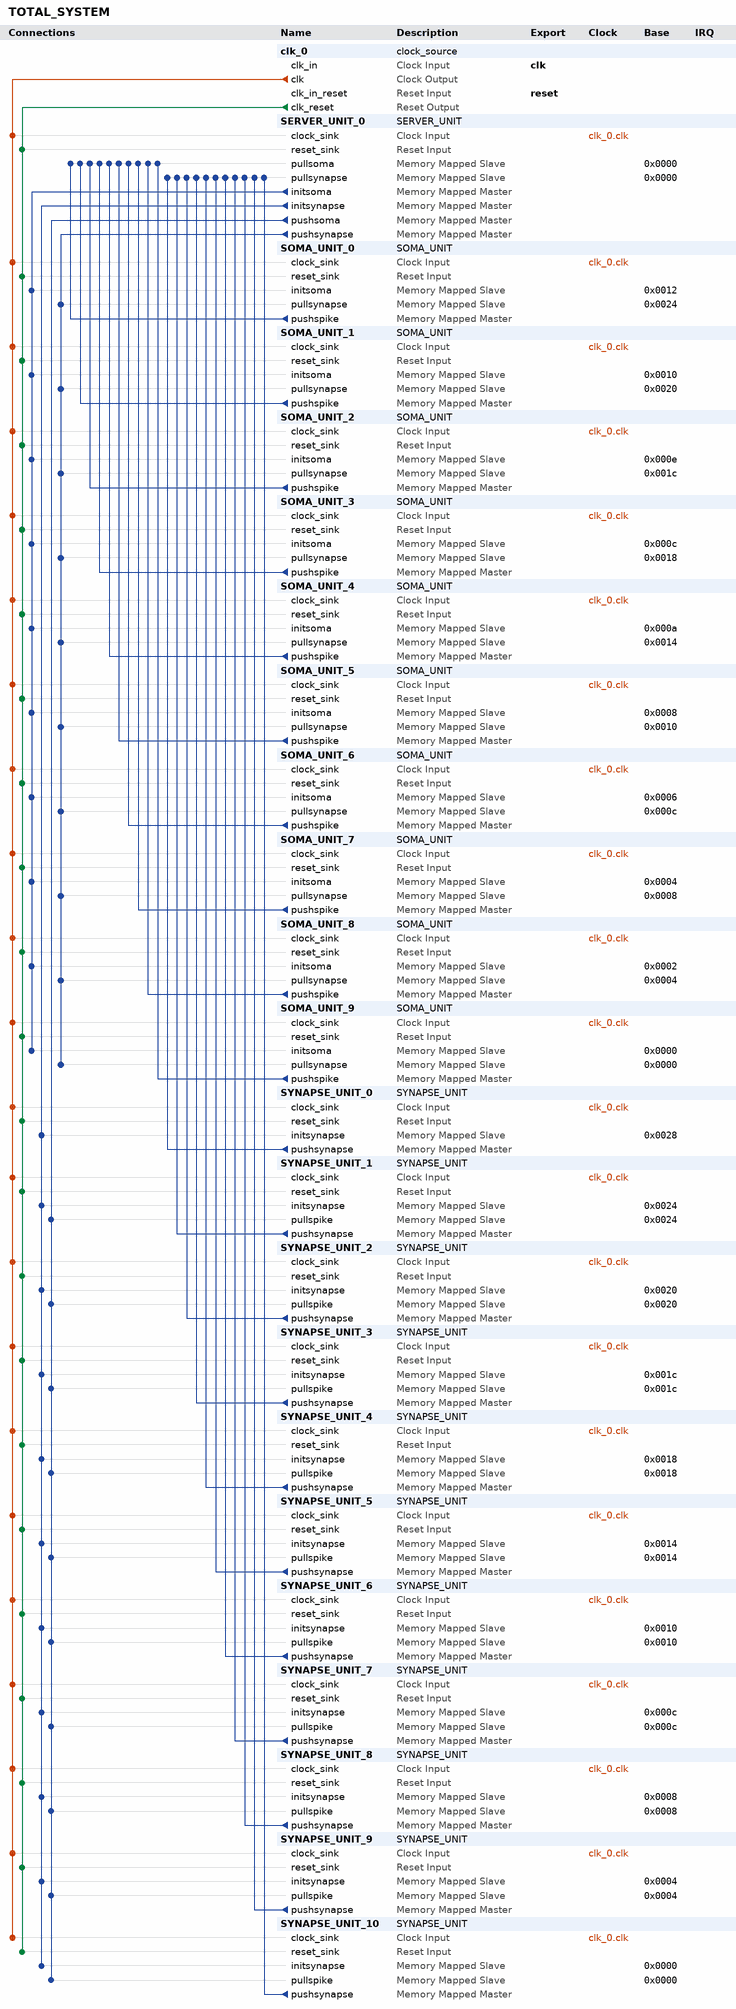
[diagram p0: system contents]
# Platform Designer (Qsys) system TOTAL_SYSTEM, Cyclone V 5CGXFC9E7F35C8
# Parameters at their usual value, and those the tool derives, are not listed.
package require -exact qsys 21.1
create_system TOTAL_SYSTEM
set_project_property DEVICE_FAMILY {Cyclone V}
set_project_property DEVICE 5CGXFC9E7F35C8

add_instance clk_0 clock_source 21.1
set_instance_parameter_value clk_0 clockFrequency 50000000

add_instance SERVER_UNIT_0 SERVER_UNIT 1.0

add_instance SOMA_UNIT_0 SOMA_UNIT 1.0
set_instance_parameter_value SOMA_UNIT_0 BYTEENABLE_WIDTH 4
set_instance_parameter_value SOMA_UNIT_0 FETCH_ADDR_WIDTH 2
set_instance_parameter_value SOMA_UNIT_0 INTERVAL_TIME_IMG 5
set_instance_parameter_value SOMA_UNIT_0 INTERVAL_TIME_REAL 5
set_instance_parameter_value SOMA_UNIT_0 INTERVAL_TIME_WIDTH 10
set_instance_parameter_value SOMA_UNIT_0 MEMBRANE_IMG 8
set_instance_parameter_value SOMA_UNIT_0 MEMBRANE_REAL 8
set_instance_parameter_value SOMA_UNIT_0 MEMBRANE_WIDTH 16
set_instance_parameter_value SOMA_UNIT_0 SERVER_ADDR_WIDTH 16
set_instance_parameter_value SOMA_UNIT_0 SPIKE_ADDR_WIDTH 32
set_instance_parameter_value SOMA_UNIT_0 SPIKE_DATA_WIDTH 16
set_instance_parameter_value SOMA_UNIT_0 SYNAPSE_ADDR_WIDTH 32
set_instance_parameter_value SOMA_UNIT_0 SYNAPSE_DATA_WIDTH 32
set_instance_parameter_value SOMA_UNIT_0 SYNAPSE_WEIGHT_IMG 8
set_instance_parameter_value SOMA_UNIT_0 SYNAPSE_WEIGHT_REAL 8
set_instance_parameter_value SOMA_UNIT_0 SYNAPSE_WEIGHT_WIDTH 16

add_instance SOMA_UNIT_1 SOMA_UNIT 1.0
set_instance_parameter_value SOMA_UNIT_1 BYTEENABLE_WIDTH 4
set_instance_parameter_value SOMA_UNIT_1 FETCH_ADDR_WIDTH 2
set_instance_parameter_value SOMA_UNIT_1 INTERVAL_TIME_IMG 5
set_instance_parameter_value SOMA_UNIT_1 INTERVAL_TIME_REAL 5
set_instance_parameter_value SOMA_UNIT_1 INTERVAL_TIME_WIDTH 10
set_instance_parameter_value SOMA_UNIT_1 MEMBRANE_IMG 8
set_instance_parameter_value SOMA_UNIT_1 MEMBRANE_REAL 8
set_instance_parameter_value SOMA_UNIT_1 MEMBRANE_WIDTH 16
set_instance_parameter_value SOMA_UNIT_1 SERVER_ADDR_WIDTH 16
set_instance_parameter_value SOMA_UNIT_1 SPIKE_ADDR_WIDTH 32
set_instance_parameter_value SOMA_UNIT_1 SPIKE_DATA_WIDTH 16
set_instance_parameter_value SOMA_UNIT_1 SYNAPSE_ADDR_WIDTH 32
set_instance_parameter_value SOMA_UNIT_1 SYNAPSE_DATA_WIDTH 32
set_instance_parameter_value SOMA_UNIT_1 SYNAPSE_WEIGHT_IMG 8
set_instance_parameter_value SOMA_UNIT_1 SYNAPSE_WEIGHT_REAL 8
set_instance_parameter_value SOMA_UNIT_1 SYNAPSE_WEIGHT_WIDTH 16

add_instance SOMA_UNIT_2 SOMA_UNIT 1.0
set_instance_parameter_value SOMA_UNIT_2 BYTEENABLE_WIDTH 4
set_instance_parameter_value SOMA_UNIT_2 FETCH_ADDR_WIDTH 2
set_instance_parameter_value SOMA_UNIT_2 INTERVAL_TIME_IMG 5
set_instance_parameter_value SOMA_UNIT_2 INTERVAL_TIME_REAL 5
set_instance_parameter_value SOMA_UNIT_2 INTERVAL_TIME_WIDTH 10
set_instance_parameter_value SOMA_UNIT_2 MEMBRANE_IMG 8
set_instance_parameter_value SOMA_UNIT_2 MEMBRANE_REAL 8
set_instance_parameter_value SOMA_UNIT_2 MEMBRANE_WIDTH 16
set_instance_parameter_value SOMA_UNIT_2 SERVER_ADDR_WIDTH 16
set_instance_parameter_value SOMA_UNIT_2 SPIKE_ADDR_WIDTH 32
set_instance_parameter_value SOMA_UNIT_2 SPIKE_DATA_WIDTH 16
set_instance_parameter_value SOMA_UNIT_2 SYNAPSE_ADDR_WIDTH 32
set_instance_parameter_value SOMA_UNIT_2 SYNAPSE_DATA_WIDTH 32
set_instance_parameter_value SOMA_UNIT_2 SYNAPSE_WEIGHT_IMG 8
set_instance_parameter_value SOMA_UNIT_2 SYNAPSE_WEIGHT_REAL 8
set_instance_parameter_value SOMA_UNIT_2 SYNAPSE_WEIGHT_WIDTH 16

add_instance SOMA_UNIT_3 SOMA_UNIT 1.0
set_instance_parameter_value SOMA_UNIT_3 BYTEENABLE_WIDTH 4
set_instance_parameter_value SOMA_UNIT_3 FETCH_ADDR_WIDTH 2
set_instance_parameter_value SOMA_UNIT_3 INTERVAL_TIME_IMG 5
set_instance_parameter_value SOMA_UNIT_3 INTERVAL_TIME_REAL 5
set_instance_parameter_value SOMA_UNIT_3 INTERVAL_TIME_WIDTH 10
set_instance_parameter_value SOMA_UNIT_3 MEMBRANE_IMG 8
set_instance_parameter_value SOMA_UNIT_3 MEMBRANE_REAL 8
set_instance_parameter_value SOMA_UNIT_3 MEMBRANE_WIDTH 16
set_instance_parameter_value SOMA_UNIT_3 SERVER_ADDR_WIDTH 16
set_instance_parameter_value SOMA_UNIT_3 SPIKE_ADDR_WIDTH 32
set_instance_parameter_value SOMA_UNIT_3 SPIKE_DATA_WIDTH 16
set_instance_parameter_value SOMA_UNIT_3 SYNAPSE_ADDR_WIDTH 32
set_instance_parameter_value SOMA_UNIT_3 SYNAPSE_DATA_WIDTH 32
set_instance_parameter_value SOMA_UNIT_3 SYNAPSE_WEIGHT_IMG 8
set_instance_parameter_value SOMA_UNIT_3 SYNAPSE_WEIGHT_REAL 8
set_instance_parameter_value SOMA_UNIT_3 SYNAPSE_WEIGHT_WIDTH 16

add_instance SOMA_UNIT_4 SOMA_UNIT 1.0
set_instance_parameter_value SOMA_UNIT_4 BYTEENABLE_WIDTH 4
set_instance_parameter_value SOMA_UNIT_4 FETCH_ADDR_WIDTH 2
set_instance_parameter_value SOMA_UNIT_4 INTERVAL_TIME_IMG 5
set_instance_parameter_value SOMA_UNIT_4 INTERVAL_TIME_REAL 5
set_instance_parameter_value SOMA_UNIT_4 INTERVAL_TIME_WIDTH 10
set_instance_parameter_value SOMA_UNIT_4 MEMBRANE_IMG 8
set_instance_parameter_value SOMA_UNIT_4 MEMBRANE_REAL 8
set_instance_parameter_value SOMA_UNIT_4 MEMBRANE_WIDTH 16
set_instance_parameter_value SOMA_UNIT_4 SERVER_ADDR_WIDTH 16
set_instance_parameter_value SOMA_UNIT_4 SPIKE_ADDR_WIDTH 32
set_instance_parameter_value SOMA_UNIT_4 SPIKE_DATA_WIDTH 16
set_instance_parameter_value SOMA_UNIT_4 SYNAPSE_ADDR_WIDTH 32
set_instance_parameter_value SOMA_UNIT_4 SYNAPSE_DATA_WIDTH 32
set_instance_parameter_value SOMA_UNIT_4 SYNAPSE_WEIGHT_IMG 8
set_instance_parameter_value SOMA_UNIT_4 SYNAPSE_WEIGHT_REAL 8
set_instance_parameter_value SOMA_UNIT_4 SYNAPSE_WEIGHT_WIDTH 16

add_instance SOMA_UNIT_5 SOMA_UNIT 1.0
set_instance_parameter_value SOMA_UNIT_5 BYTEENABLE_WIDTH 4
set_instance_parameter_value SOMA_UNIT_5 FETCH_ADDR_WIDTH 2
set_instance_parameter_value SOMA_UNIT_5 INTERVAL_TIME_IMG 5
set_instance_parameter_value SOMA_UNIT_5 INTERVAL_TIME_REAL 5
set_instance_parameter_value SOMA_UNIT_5 INTERVAL_TIME_WIDTH 10
set_instance_parameter_value SOMA_UNIT_5 MEMBRANE_IMG 8
set_instance_parameter_value SOMA_UNIT_5 MEMBRANE_REAL 8
set_instance_parameter_value SOMA_UNIT_5 MEMBRANE_WIDTH 16
set_instance_parameter_value SOMA_UNIT_5 SERVER_ADDR_WIDTH 16
set_instance_parameter_value SOMA_UNIT_5 SPIKE_ADDR_WIDTH 32
set_instance_parameter_value SOMA_UNIT_5 SPIKE_DATA_WIDTH 16
set_instance_parameter_value SOMA_UNIT_5 SYNAPSE_ADDR_WIDTH 32
set_instance_parameter_value SOMA_UNIT_5 SYNAPSE_DATA_WIDTH 32
set_instance_parameter_value SOMA_UNIT_5 SYNAPSE_WEIGHT_IMG 8
set_instance_parameter_value SOMA_UNIT_5 SYNAPSE_WEIGHT_REAL 8
set_instance_parameter_value SOMA_UNIT_5 SYNAPSE_WEIGHT_WIDTH 16

add_instance SOMA_UNIT_6 SOMA_UNIT 1.0
set_instance_parameter_value SOMA_UNIT_6 BYTEENABLE_WIDTH 4
set_instance_parameter_value SOMA_UNIT_6 FETCH_ADDR_WIDTH 2
set_instance_parameter_value SOMA_UNIT_6 INTERVAL_TIME_IMG 5
set_instance_parameter_value SOMA_UNIT_6 INTERVAL_TIME_REAL 5
set_instance_parameter_value SOMA_UNIT_6 INTERVAL_TIME_WIDTH 10
set_instance_parameter_value SOMA_UNIT_6 MEMBRANE_IMG 8
set_instance_parameter_value SOMA_UNIT_6 MEMBRANE_REAL 8
set_instance_parameter_value SOMA_UNIT_6 MEMBRANE_WIDTH 16
set_instance_parameter_value SOMA_UNIT_6 SERVER_ADDR_WIDTH 16
set_instance_parameter_value SOMA_UNIT_6 SPIKE_ADDR_WIDTH 32
set_instance_parameter_value SOMA_UNIT_6 SPIKE_DATA_WIDTH 16
set_instance_parameter_value SOMA_UNIT_6 SYNAPSE_ADDR_WIDTH 32
set_instance_parameter_value SOMA_UNIT_6 SYNAPSE_DATA_WIDTH 32
set_instance_parameter_value SOMA_UNIT_6 SYNAPSE_WEIGHT_IMG 8
set_instance_parameter_value SOMA_UNIT_6 SYNAPSE_WEIGHT_REAL 8
set_instance_parameter_value SOMA_UNIT_6 SYNAPSE_WEIGHT_WIDTH 16

add_instance SOMA_UNIT_7 SOMA_UNIT 1.0
set_instance_parameter_value SOMA_UNIT_7 BYTEENABLE_WIDTH 4
set_instance_parameter_value SOMA_UNIT_7 FETCH_ADDR_WIDTH 2
set_instance_parameter_value SOMA_UNIT_7 INTERVAL_TIME_IMG 5
set_instance_parameter_value SOMA_UNIT_7 INTERVAL_TIME_REAL 5
set_instance_parameter_value SOMA_UNIT_7 INTERVAL_TIME_WIDTH 10
set_instance_parameter_value SOMA_UNIT_7 MEMBRANE_IMG 8
set_instance_parameter_value SOMA_UNIT_7 MEMBRANE_REAL 8
set_instance_parameter_value SOMA_UNIT_7 MEMBRANE_WIDTH 16
set_instance_parameter_value SOMA_UNIT_7 SERVER_ADDR_WIDTH 16
set_instance_parameter_value SOMA_UNIT_7 SPIKE_ADDR_WIDTH 32
set_instance_parameter_value SOMA_UNIT_7 SPIKE_DATA_WIDTH 16
set_instance_parameter_value SOMA_UNIT_7 SYNAPSE_ADDR_WIDTH 32
set_instance_parameter_value SOMA_UNIT_7 SYNAPSE_DATA_WIDTH 32
set_instance_parameter_value SOMA_UNIT_7 SYNAPSE_WEIGHT_IMG 8
set_instance_parameter_value SOMA_UNIT_7 SYNAPSE_WEIGHT_REAL 8
set_instance_parameter_value SOMA_UNIT_7 SYNAPSE_WEIGHT_WIDTH 16

add_instance SOMA_UNIT_8 SOMA_UNIT 1.0
set_instance_parameter_value SOMA_UNIT_8 BYTEENABLE_WIDTH 4
set_instance_parameter_value SOMA_UNIT_8 FETCH_ADDR_WIDTH 2
set_instance_parameter_value SOMA_UNIT_8 INTERVAL_TIME_IMG 5
set_instance_parameter_value SOMA_UNIT_8 INTERVAL_TIME_REAL 5
set_instance_parameter_value SOMA_UNIT_8 INTERVAL_TIME_WIDTH 10
set_instance_parameter_value SOMA_UNIT_8 MEMBRANE_IMG 8
set_instance_parameter_value SOMA_UNIT_8 MEMBRANE_REAL 8
set_instance_parameter_value SOMA_UNIT_8 MEMBRANE_WIDTH 16
set_instance_parameter_value SOMA_UNIT_8 SERVER_ADDR_WIDTH 16
set_instance_parameter_value SOMA_UNIT_8 SPIKE_ADDR_WIDTH 32
set_instance_parameter_value SOMA_UNIT_8 SPIKE_DATA_WIDTH 16
set_instance_parameter_value SOMA_UNIT_8 SYNAPSE_ADDR_WIDTH 32
set_instance_parameter_value SOMA_UNIT_8 SYNAPSE_DATA_WIDTH 32
set_instance_parameter_value SOMA_UNIT_8 SYNAPSE_WEIGHT_IMG 8
set_instance_parameter_value SOMA_UNIT_8 SYNAPSE_WEIGHT_REAL 8
set_instance_parameter_value SOMA_UNIT_8 SYNAPSE_WEIGHT_WIDTH 16

add_instance SOMA_UNIT_9 SOMA_UNIT 1.0
set_instance_parameter_value SOMA_UNIT_9 BYTEENABLE_WIDTH 4
set_instance_parameter_value SOMA_UNIT_9 FETCH_ADDR_WIDTH 2
set_instance_parameter_value SOMA_UNIT_9 INTERVAL_TIME_IMG 5
set_instance_parameter_value SOMA_UNIT_9 INTERVAL_TIME_REAL 5
set_instance_parameter_value SOMA_UNIT_9 INTERVAL_TIME_WIDTH 10
set_instance_parameter_value SOMA_UNIT_9 MEMBRANE_IMG 8
set_instance_parameter_value SOMA_UNIT_9 MEMBRANE_REAL 8
set_instance_parameter_value SOMA_UNIT_9 MEMBRANE_WIDTH 16
set_instance_parameter_value SOMA_UNIT_9 SERVER_ADDR_WIDTH 16
set_instance_parameter_value SOMA_UNIT_9 SPIKE_ADDR_WIDTH 32
set_instance_parameter_value SOMA_UNIT_9 SPIKE_DATA_WIDTH 16
set_instance_parameter_value SOMA_UNIT_9 SYNAPSE_ADDR_WIDTH 32
set_instance_parameter_value SOMA_UNIT_9 SYNAPSE_DATA_WIDTH 32
set_instance_parameter_value SOMA_UNIT_9 SYNAPSE_WEIGHT_IMG 8
set_instance_parameter_value SOMA_UNIT_9 SYNAPSE_WEIGHT_REAL 8
set_instance_parameter_value SOMA_UNIT_9 SYNAPSE_WEIGHT_WIDTH 16

add_instance SYNAPSE_UNIT_0 SYNAPSE_UNIT 1.0
set_instance_parameter_value SYNAPSE_UNIT_0 NUM_STDP_POST_NEURONS 2
set_instance_parameter_value SYNAPSE_UNIT_0 NUM_STDP_PRE_NEURONS 4
set_instance_parameter_value SYNAPSE_UNIT_0 WIDTH_STDP_ADDR_POST 1
set_instance_parameter_value SYNAPSE_UNIT_0 WIDTH_STDP_ADDR_PRE 2

add_instance SYNAPSE_UNIT_1 SYNAPSE_UNIT 1.0
set_instance_parameter_value SYNAPSE_UNIT_1 NUM_STDP_POST_NEURONS 2
set_instance_parameter_value SYNAPSE_UNIT_1 NUM_STDP_PRE_NEURONS 4
set_instance_parameter_value SYNAPSE_UNIT_1 WIDTH_STDP_ADDR_POST 1
set_instance_parameter_value SYNAPSE_UNIT_1 WIDTH_STDP_ADDR_PRE 2

add_instance SYNAPSE_UNIT_2 SYNAPSE_UNIT 1.0
set_instance_parameter_value SYNAPSE_UNIT_2 NUM_STDP_POST_NEURONS 2
set_instance_parameter_value SYNAPSE_UNIT_2 NUM_STDP_PRE_NEURONS 4
set_instance_parameter_value SYNAPSE_UNIT_2 WIDTH_STDP_ADDR_POST 1
set_instance_parameter_value SYNAPSE_UNIT_2 WIDTH_STDP_ADDR_PRE 2

add_instance SYNAPSE_UNIT_3 SYNAPSE_UNIT 1.0
set_instance_parameter_value SYNAPSE_UNIT_3 NUM_STDP_POST_NEURONS 2
set_instance_parameter_value SYNAPSE_UNIT_3 NUM_STDP_PRE_NEURONS 4
set_instance_parameter_value SYNAPSE_UNIT_3 WIDTH_STDP_ADDR_POST 1
set_instance_parameter_value SYNAPSE_UNIT_3 WIDTH_STDP_ADDR_PRE 2

add_instance SYNAPSE_UNIT_4 SYNAPSE_UNIT 1.0
set_instance_parameter_value SYNAPSE_UNIT_4 NUM_STDP_POST_NEURONS 2
set_instance_parameter_value SYNAPSE_UNIT_4 NUM_STDP_PRE_NEURONS 4
set_instance_parameter_value SYNAPSE_UNIT_4 WIDTH_STDP_ADDR_POST 1
set_instance_parameter_value SYNAPSE_UNIT_4 WIDTH_STDP_ADDR_PRE 2

add_instance SYNAPSE_UNIT_5 SYNAPSE_UNIT 1.0
set_instance_parameter_value SYNAPSE_UNIT_5 NUM_STDP_POST_NEURONS 2
set_instance_parameter_value SYNAPSE_UNIT_5 NUM_STDP_PRE_NEURONS 4
set_instance_parameter_value SYNAPSE_UNIT_5 WIDTH_STDP_ADDR_POST 1
set_instance_parameter_value SYNAPSE_UNIT_5 WIDTH_STDP_ADDR_PRE 2

add_instance SYNAPSE_UNIT_6 SYNAPSE_UNIT 1.0
set_instance_parameter_value SYNAPSE_UNIT_6 NUM_STDP_POST_NEURONS 2
set_instance_parameter_value SYNAPSE_UNIT_6 NUM_STDP_PRE_NEURONS 4
set_instance_parameter_value SYNAPSE_UNIT_6 WIDTH_STDP_ADDR_POST 1
set_instance_parameter_value SYNAPSE_UNIT_6 WIDTH_STDP_ADDR_PRE 2

add_instance SYNAPSE_UNIT_7 SYNAPSE_UNIT 1.0
set_instance_parameter_value SYNAPSE_UNIT_7 NUM_STDP_POST_NEURONS 2
set_instance_parameter_value SYNAPSE_UNIT_7 NUM_STDP_PRE_NEURONS 4
set_instance_parameter_value SYNAPSE_UNIT_7 WIDTH_STDP_ADDR_POST 1
set_instance_parameter_value SYNAPSE_UNIT_7 WIDTH_STDP_ADDR_PRE 2

add_instance SYNAPSE_UNIT_8 SYNAPSE_UNIT 1.0
set_instance_parameter_value SYNAPSE_UNIT_8 NUM_STDP_POST_NEURONS 2
set_instance_parameter_value SYNAPSE_UNIT_8 NUM_STDP_PRE_NEURONS 4
set_instance_parameter_value SYNAPSE_UNIT_8 WIDTH_STDP_ADDR_POST 1
set_instance_parameter_value SYNAPSE_UNIT_8 WIDTH_STDP_ADDR_PRE 2

add_instance SYNAPSE_UNIT_9 SYNAPSE_UNIT 1.0
set_instance_parameter_value SYNAPSE_UNIT_9 NUM_STDP_POST_NEURONS 2
set_instance_parameter_value SYNAPSE_UNIT_9 NUM_STDP_PRE_NEURONS 4
set_instance_parameter_value SYNAPSE_UNIT_9 WIDTH_STDP_ADDR_POST 1
set_instance_parameter_value SYNAPSE_UNIT_9 WIDTH_STDP_ADDR_PRE 2

add_instance SYNAPSE_UNIT_10 SYNAPSE_UNIT 1.0
set_instance_parameter_value SYNAPSE_UNIT_10 NUM_STDP_POST_NEURONS 2
set_instance_parameter_value SYNAPSE_UNIT_10 NUM_STDP_PRE_NEURONS 4
set_instance_parameter_value SYNAPSE_UNIT_10 WIDTH_STDP_ADDR_POST 1
set_instance_parameter_value SYNAPSE_UNIT_10 WIDTH_STDP_ADDR_PRE 2

# connections
add_connection clk_0.clk SERVER_UNIT_0.clock_sink clock
add_connection clk_0.clk SOMA_UNIT_0.clock_sink clock
add_connection clk_0.clk SOMA_UNIT_1.clock_sink clock
add_connection clk_0.clk SOMA_UNIT_2.clock_sink clock
add_connection clk_0.clk SOMA_UNIT_3.clock_sink clock
add_connection clk_0.clk SOMA_UNIT_4.clock_sink clock
add_connection clk_0.clk SOMA_UNIT_5.clock_sink clock
add_connection clk_0.clk SOMA_UNIT_6.clock_sink clock
add_connection clk_0.clk SOMA_UNIT_7.clock_sink clock
add_connection clk_0.clk SOMA_UNIT_8.clock_sink clock
add_connection clk_0.clk SOMA_UNIT_9.clock_sink clock
add_connection clk_0.clk SYNAPSE_UNIT_0.clock_sink clock
add_connection clk_0.clk SYNAPSE_UNIT_1.clock_sink clock
add_connection clk_0.clk SYNAPSE_UNIT_2.clock_sink clock
add_connection clk_0.clk SYNAPSE_UNIT_3.clock_sink clock
add_connection clk_0.clk SYNAPSE_UNIT_4.clock_sink clock
add_connection clk_0.clk SYNAPSE_UNIT_5.clock_sink clock
add_connection clk_0.clk SYNAPSE_UNIT_6.clock_sink clock
add_connection clk_0.clk SYNAPSE_UNIT_7.clock_sink clock
add_connection clk_0.clk SYNAPSE_UNIT_8.clock_sink clock
add_connection clk_0.clk SYNAPSE_UNIT_9.clock_sink clock
add_connection clk_0.clk SYNAPSE_UNIT_10.clock_sink clock
add_connection clk_0.clk_reset SERVER_UNIT_0.reset_sink reset
add_connection clk_0.clk_reset SOMA_UNIT_0.reset_sink reset
add_connection clk_0.clk_reset SOMA_UNIT_1.reset_sink reset
add_connection clk_0.clk_reset SOMA_UNIT_2.reset_sink reset
add_connection clk_0.clk_reset SOMA_UNIT_3.reset_sink reset
add_connection clk_0.clk_reset SOMA_UNIT_4.reset_sink reset
add_connection clk_0.clk_reset SOMA_UNIT_5.reset_sink reset
add_connection clk_0.clk_reset SOMA_UNIT_6.reset_sink reset
add_connection clk_0.clk_reset SOMA_UNIT_7.reset_sink reset
add_connection clk_0.clk_reset SOMA_UNIT_8.reset_sink reset
add_connection clk_0.clk_reset SOMA_UNIT_9.reset_sink reset
add_connection clk_0.clk_reset SYNAPSE_UNIT_0.reset_sink reset
add_connection clk_0.clk_reset SYNAPSE_UNIT_1.reset_sink reset
add_connection clk_0.clk_reset SYNAPSE_UNIT_2.reset_sink reset
add_connection clk_0.clk_reset SYNAPSE_UNIT_3.reset_sink reset
add_connection clk_0.clk_reset SYNAPSE_UNIT_4.reset_sink reset
add_connection clk_0.clk_reset SYNAPSE_UNIT_5.reset_sink reset
add_connection clk_0.clk_reset SYNAPSE_UNIT_6.reset_sink reset
add_connection clk_0.clk_reset SYNAPSE_UNIT_7.reset_sink reset
add_connection clk_0.clk_reset SYNAPSE_UNIT_8.reset_sink reset
add_connection clk_0.clk_reset SYNAPSE_UNIT_9.reset_sink reset
add_connection clk_0.clk_reset SYNAPSE_UNIT_10.reset_sink reset
add_connection SERVER_UNIT_0.initsoma SOMA_UNIT_0.initsoma avalon
set_connection_parameter_value SERVER_UNIT_0.initsoma/SOMA_UNIT_0.initsoma baseAddress 0x0012
add_connection SERVER_UNIT_0.initsoma SOMA_UNIT_1.initsoma avalon
set_connection_parameter_value SERVER_UNIT_0.initsoma/SOMA_UNIT_1.initsoma baseAddress 0x0010
add_connection SERVER_UNIT_0.initsoma SOMA_UNIT_2.initsoma avalon
set_connection_parameter_value SERVER_UNIT_0.initsoma/SOMA_UNIT_2.initsoma baseAddress 0x000e
add_connection SERVER_UNIT_0.initsoma SOMA_UNIT_3.initsoma avalon
set_connection_parameter_value SERVER_UNIT_0.initsoma/SOMA_UNIT_3.initsoma baseAddress 0x000c
add_connection SERVER_UNIT_0.initsoma SOMA_UNIT_4.initsoma avalon
set_connection_parameter_value SERVER_UNIT_0.initsoma/SOMA_UNIT_4.initsoma baseAddress 0x000a
add_connection SERVER_UNIT_0.initsoma SOMA_UNIT_5.initsoma avalon
set_connection_parameter_value SERVER_UNIT_0.initsoma/SOMA_UNIT_5.initsoma baseAddress 0x0008
add_connection SERVER_UNIT_0.initsoma SOMA_UNIT_6.initsoma avalon
set_connection_parameter_value SERVER_UNIT_0.initsoma/SOMA_UNIT_6.initsoma baseAddress 0x0006
add_connection SERVER_UNIT_0.initsoma SOMA_UNIT_7.initsoma avalon
set_connection_parameter_value SERVER_UNIT_0.initsoma/SOMA_UNIT_7.initsoma baseAddress 0x0004
add_connection SERVER_UNIT_0.initsoma SOMA_UNIT_8.initsoma avalon
set_connection_parameter_value SERVER_UNIT_0.initsoma/SOMA_UNIT_8.initsoma baseAddress 0x0002
add_connection SERVER_UNIT_0.initsoma SOMA_UNIT_9.initsoma avalon
set_connection_parameter_value SERVER_UNIT_0.initsoma/SOMA_UNIT_9.initsoma baseAddress 0x0000
add_connection SERVER_UNIT_0.initsynapse SYNAPSE_UNIT_0.initsynapse avalon
set_connection_parameter_value SERVER_UNIT_0.initsynapse/SYNAPSE_UNIT_0.initsynapse baseAddress 0x0028
add_connection SERVER_UNIT_0.initsynapse SYNAPSE_UNIT_1.initsynapse avalon
set_connection_parameter_value SERVER_UNIT_0.initsynapse/SYNAPSE_UNIT_1.initsynapse baseAddress 0x0024
add_connection SERVER_UNIT_0.initsynapse SYNAPSE_UNIT_2.initsynapse avalon
set_connection_parameter_value SERVER_UNIT_0.initsynapse/SYNAPSE_UNIT_2.initsynapse baseAddress 0x0020
add_connection SERVER_UNIT_0.initsynapse SYNAPSE_UNIT_3.initsynapse avalon
set_connection_parameter_value SERVER_UNIT_0.initsynapse/SYNAPSE_UNIT_3.initsynapse baseAddress 0x001c
add_connection SERVER_UNIT_0.initsynapse SYNAPSE_UNIT_4.initsynapse avalon
set_connection_parameter_value SERVER_UNIT_0.initsynapse/SYNAPSE_UNIT_4.initsynapse baseAddress 0x0018
add_connection SERVER_UNIT_0.initsynapse SYNAPSE_UNIT_5.initsynapse avalon
set_connection_parameter_value SERVER_UNIT_0.initsynapse/SYNAPSE_UNIT_5.initsynapse baseAddress 0x0014
add_connection SERVER_UNIT_0.initsynapse SYNAPSE_UNIT_6.initsynapse avalon
set_connection_parameter_value SERVER_UNIT_0.initsynapse/SYNAPSE_UNIT_6.initsynapse baseAddress 0x0010
add_connection SERVER_UNIT_0.initsynapse SYNAPSE_UNIT_7.initsynapse avalon
set_connection_parameter_value SERVER_UNIT_0.initsynapse/SYNAPSE_UNIT_7.initsynapse baseAddress 0x000c
add_connection SERVER_UNIT_0.initsynapse SYNAPSE_UNIT_8.initsynapse avalon
set_connection_parameter_value SERVER_UNIT_0.initsynapse/SYNAPSE_UNIT_8.initsynapse baseAddress 0x0008
add_connection SERVER_UNIT_0.initsynapse SYNAPSE_UNIT_9.initsynapse avalon
set_connection_parameter_value SERVER_UNIT_0.initsynapse/SYNAPSE_UNIT_9.initsynapse baseAddress 0x0004
add_connection SERVER_UNIT_0.initsynapse SYNAPSE_UNIT_10.initsynapse avalon
set_connection_parameter_value SERVER_UNIT_0.initsynapse/SYNAPSE_UNIT_10.initsynapse baseAddress 0x0000
add_connection SERVER_UNIT_0.pushsoma SYNAPSE_UNIT_1.pullspike avalon
set_connection_parameter_value SERVER_UNIT_0.pushsoma/SYNAPSE_UNIT_1.pullspike baseAddress 0x0024
add_connection SERVER_UNIT_0.pushsoma SYNAPSE_UNIT_2.pullspike avalon
set_connection_parameter_value SERVER_UNIT_0.pushsoma/SYNAPSE_UNIT_2.pullspike baseAddress 0x0020
add_connection SERVER_UNIT_0.pushsoma SYNAPSE_UNIT_3.pullspike avalon
set_connection_parameter_value SERVER_UNIT_0.pushsoma/SYNAPSE_UNIT_3.pullspike baseAddress 0x001c
add_connection SERVER_UNIT_0.pushsoma SYNAPSE_UNIT_4.pullspike avalon
set_connection_parameter_value SERVER_UNIT_0.pushsoma/SYNAPSE_UNIT_4.pullspike baseAddress 0x0018
add_connection SERVER_UNIT_0.pushsoma SYNAPSE_UNIT_5.pullspike avalon
set_connection_parameter_value SERVER_UNIT_0.pushsoma/SYNAPSE_UNIT_5.pullspike baseAddress 0x0014
add_connection SERVER_UNIT_0.pushsoma SYNAPSE_UNIT_6.pullspike avalon
set_connection_parameter_value SERVER_UNIT_0.pushsoma/SYNAPSE_UNIT_6.pullspike baseAddress 0x0010
add_connection SERVER_UNIT_0.pushsoma SYNAPSE_UNIT_7.pullspike avalon
set_connection_parameter_value SERVER_UNIT_0.pushsoma/SYNAPSE_UNIT_7.pullspike baseAddress 0x000c
add_connection SERVER_UNIT_0.pushsoma SYNAPSE_UNIT_8.pullspike avalon
set_connection_parameter_value SERVER_UNIT_0.pushsoma/SYNAPSE_UNIT_8.pullspike baseAddress 0x0008
add_connection SERVER_UNIT_0.pushsoma SYNAPSE_UNIT_9.pullspike avalon
set_connection_parameter_value SERVER_UNIT_0.pushsoma/SYNAPSE_UNIT_9.pullspike baseAddress 0x0004
add_connection SERVER_UNIT_0.pushsoma SYNAPSE_UNIT_10.pullspike avalon
set_connection_parameter_value SERVER_UNIT_0.pushsoma/SYNAPSE_UNIT_10.pullspike baseAddress 0x0000
add_connection SERVER_UNIT_0.pushsynapse SOMA_UNIT_0.pullsynapse avalon
set_connection_parameter_value SERVER_UNIT_0.pushsynapse/SOMA_UNIT_0.pullsynapse baseAddress 0x0024
add_connection SERVER_UNIT_0.pushsynapse SOMA_UNIT_1.pullsynapse avalon
set_connection_parameter_value SERVER_UNIT_0.pushsynapse/SOMA_UNIT_1.pullsynapse baseAddress 0x0020
add_connection SERVER_UNIT_0.pushsynapse SOMA_UNIT_2.pullsynapse avalon
set_connection_parameter_value SERVER_UNIT_0.pushsynapse/SOMA_UNIT_2.pullsynapse baseAddress 0x001c
add_connection SERVER_UNIT_0.pushsynapse SOMA_UNIT_3.pullsynapse avalon
set_connection_parameter_value SERVER_UNIT_0.pushsynapse/SOMA_UNIT_3.pullsynapse baseAddress 0x0018
add_connection SERVER_UNIT_0.pushsynapse SOMA_UNIT_4.pullsynapse avalon
set_connection_parameter_value SERVER_UNIT_0.pushsynapse/SOMA_UNIT_4.pullsynapse baseAddress 0x0014
add_connection SERVER_UNIT_0.pushsynapse SOMA_UNIT_5.pullsynapse avalon
set_connection_parameter_value SERVER_UNIT_0.pushsynapse/SOMA_UNIT_5.pullsynapse baseAddress 0x0010
add_connection SERVER_UNIT_0.pushsynapse SOMA_UNIT_6.pullsynapse avalon
set_connection_parameter_value SERVER_UNIT_0.pushsynapse/SOMA_UNIT_6.pullsynapse baseAddress 0x000c
add_connection SERVER_UNIT_0.pushsynapse SOMA_UNIT_7.pullsynapse avalon
set_connection_parameter_value SERVER_UNIT_0.pushsynapse/SOMA_UNIT_7.pullsynapse baseAddress 0x0008
add_connection SERVER_UNIT_0.pushsynapse SOMA_UNIT_8.pullsynapse avalon
set_connection_parameter_value SERVER_UNIT_0.pushsynapse/SOMA_UNIT_8.pullsynapse baseAddress 0x0004
add_connection SERVER_UNIT_0.pushsynapse SOMA_UNIT_9.pullsynapse avalon
set_connection_parameter_value SERVER_UNIT_0.pushsynapse/SOMA_UNIT_9.pullsynapse baseAddress 0x0000
add_connection SOMA_UNIT_0.pushspike SERVER_UNIT_0.pullsoma avalon
set_connection_parameter_value SOMA_UNIT_0.pushspike/SERVER_UNIT_0.pullsoma baseAddress 0x0000
add_connection SOMA_UNIT_1.pushspike SERVER_UNIT_0.pullsoma avalon
set_connection_parameter_value SOMA_UNIT_1.pushspike/SERVER_UNIT_0.pullsoma baseAddress 0x0000
add_connection SOMA_UNIT_2.pushspike SERVER_UNIT_0.pullsoma avalon
set_connection_parameter_value SOMA_UNIT_2.pushspike/SERVER_UNIT_0.pullsoma baseAddress 0x0000
add_connection SOMA_UNIT_3.pushspike SERVER_UNIT_0.pullsoma avalon
set_connection_parameter_value SOMA_UNIT_3.pushspike/SERVER_UNIT_0.pullsoma baseAddress 0x0000
add_connection SOMA_UNIT_4.pushspike SERVER_UNIT_0.pullsoma avalon
set_connection_parameter_value SOMA_UNIT_4.pushspike/SERVER_UNIT_0.pullsoma baseAddress 0x0000
add_connection SOMA_UNIT_5.pushspike SERVER_UNIT_0.pullsoma avalon
set_connection_parameter_value SOMA_UNIT_5.pushspike/SERVER_UNIT_0.pullsoma baseAddress 0x0000
add_connection SOMA_UNIT_6.pushspike SERVER_UNIT_0.pullsoma avalon
set_connection_parameter_value SOMA_UNIT_6.pushspike/SERVER_UNIT_0.pullsoma baseAddress 0x0000
add_connection SOMA_UNIT_7.pushspike SERVER_UNIT_0.pullsoma avalon
set_connection_parameter_value SOMA_UNIT_7.pushspike/SERVER_UNIT_0.pullsoma baseAddress 0x0000
add_connection SOMA_UNIT_8.pushspike SERVER_UNIT_0.pullsoma avalon
set_connection_parameter_value SOMA_UNIT_8.pushspike/SERVER_UNIT_0.pullsoma baseAddress 0x0000
add_connection SOMA_UNIT_9.pushspike SERVER_UNIT_0.pullsoma avalon
set_connection_parameter_value SOMA_UNIT_9.pushspike/SERVER_UNIT_0.pullsoma baseAddress 0x0000
add_connection SYNAPSE_UNIT_0.pushsynapse SERVER_UNIT_0.pullsynapse avalon
set_connection_parameter_value SYNAPSE_UNIT_0.pushsynapse/SERVER_UNIT_0.pullsynapse baseAddress 0x0000
add_connection SYNAPSE_UNIT_1.pushsynapse SERVER_UNIT_0.pullsynapse avalon
set_connection_parameter_value SYNAPSE_UNIT_1.pushsynapse/SERVER_UNIT_0.pullsynapse baseAddress 0x0000
add_connection SYNAPSE_UNIT_2.pushsynapse SERVER_UNIT_0.pullsynapse avalon
set_connection_parameter_value SYNAPSE_UNIT_2.pushsynapse/SERVER_UNIT_0.pullsynapse baseAddress 0x0000
add_connection SYNAPSE_UNIT_3.pushsynapse SERVER_UNIT_0.pullsynapse avalon
set_connection_parameter_value SYNAPSE_UNIT_3.pushsynapse/SERVER_UNIT_0.pullsynapse baseAddress 0x0000
add_connection SYNAPSE_UNIT_4.pushsynapse SERVER_UNIT_0.pullsynapse avalon
set_connection_parameter_value SYNAPSE_UNIT_4.pushsynapse/SERVER_UNIT_0.pullsynapse baseAddress 0x0000
add_connection SYNAPSE_UNIT_5.pushsynapse SERVER_UNIT_0.pullsynapse avalon
set_connection_parameter_value SYNAPSE_UNIT_5.pushsynapse/SERVER_UNIT_0.pullsynapse baseAddress 0x0000
add_connection SYNAPSE_UNIT_6.pushsynapse SERVER_UNIT_0.pullsynapse avalon
set_connection_parameter_value SYNAPSE_UNIT_6.pushsynapse/SERVER_UNIT_0.pullsynapse baseAddress 0x0000
add_connection SYNAPSE_UNIT_7.pushsynapse SERVER_UNIT_0.pullsynapse avalon
set_connection_parameter_value SYNAPSE_UNIT_7.pushsynapse/SERVER_UNIT_0.pullsynapse baseAddress 0x0000
add_connection SYNAPSE_UNIT_8.pushsynapse SERVER_UNIT_0.pullsynapse avalon
set_connection_parameter_value SYNAPSE_UNIT_8.pushsynapse/SERVER_UNIT_0.pullsynapse baseAddress 0x0000
add_connection SYNAPSE_UNIT_9.pushsynapse SERVER_UNIT_0.pullsynapse avalon
set_connection_parameter_value SYNAPSE_UNIT_9.pushsynapse/SERVER_UNIT_0.pullsynapse baseAddress 0x0000
add_connection SYNAPSE_UNIT_10.pushsynapse SERVER_UNIT_0.pullsynapse avalon
set_connection_parameter_value SYNAPSE_UNIT_10.pushsynapse/SERVER_UNIT_0.pullsynapse baseAddress 0x0000

# exported interfaces
add_interface clk clock sink
set_interface_property clk EXPORT_OF clk_0.clk_in
add_interface reset reset sink
set_interface_property reset EXPORT_OF clk_0.clk_in_reset

set_interconnect_requirement {$system} qsys_mm.clockCrossingAdapter HANDSHAKE
set_interconnect_requirement {$system} qsys_mm.enableEccProtection FALSE
set_interconnect_requirement {$system} qsys_mm.insertDefaultSlave FALSE
set_interconnect_requirement {$system} qsys_mm.maxAdditionalLatency 1

save_system TOTAL_SYSTEM.qsys
